# EAGLE design Wheel_Encoder_Adapter_Schmitt_74LVC (EAGLE 6.3)
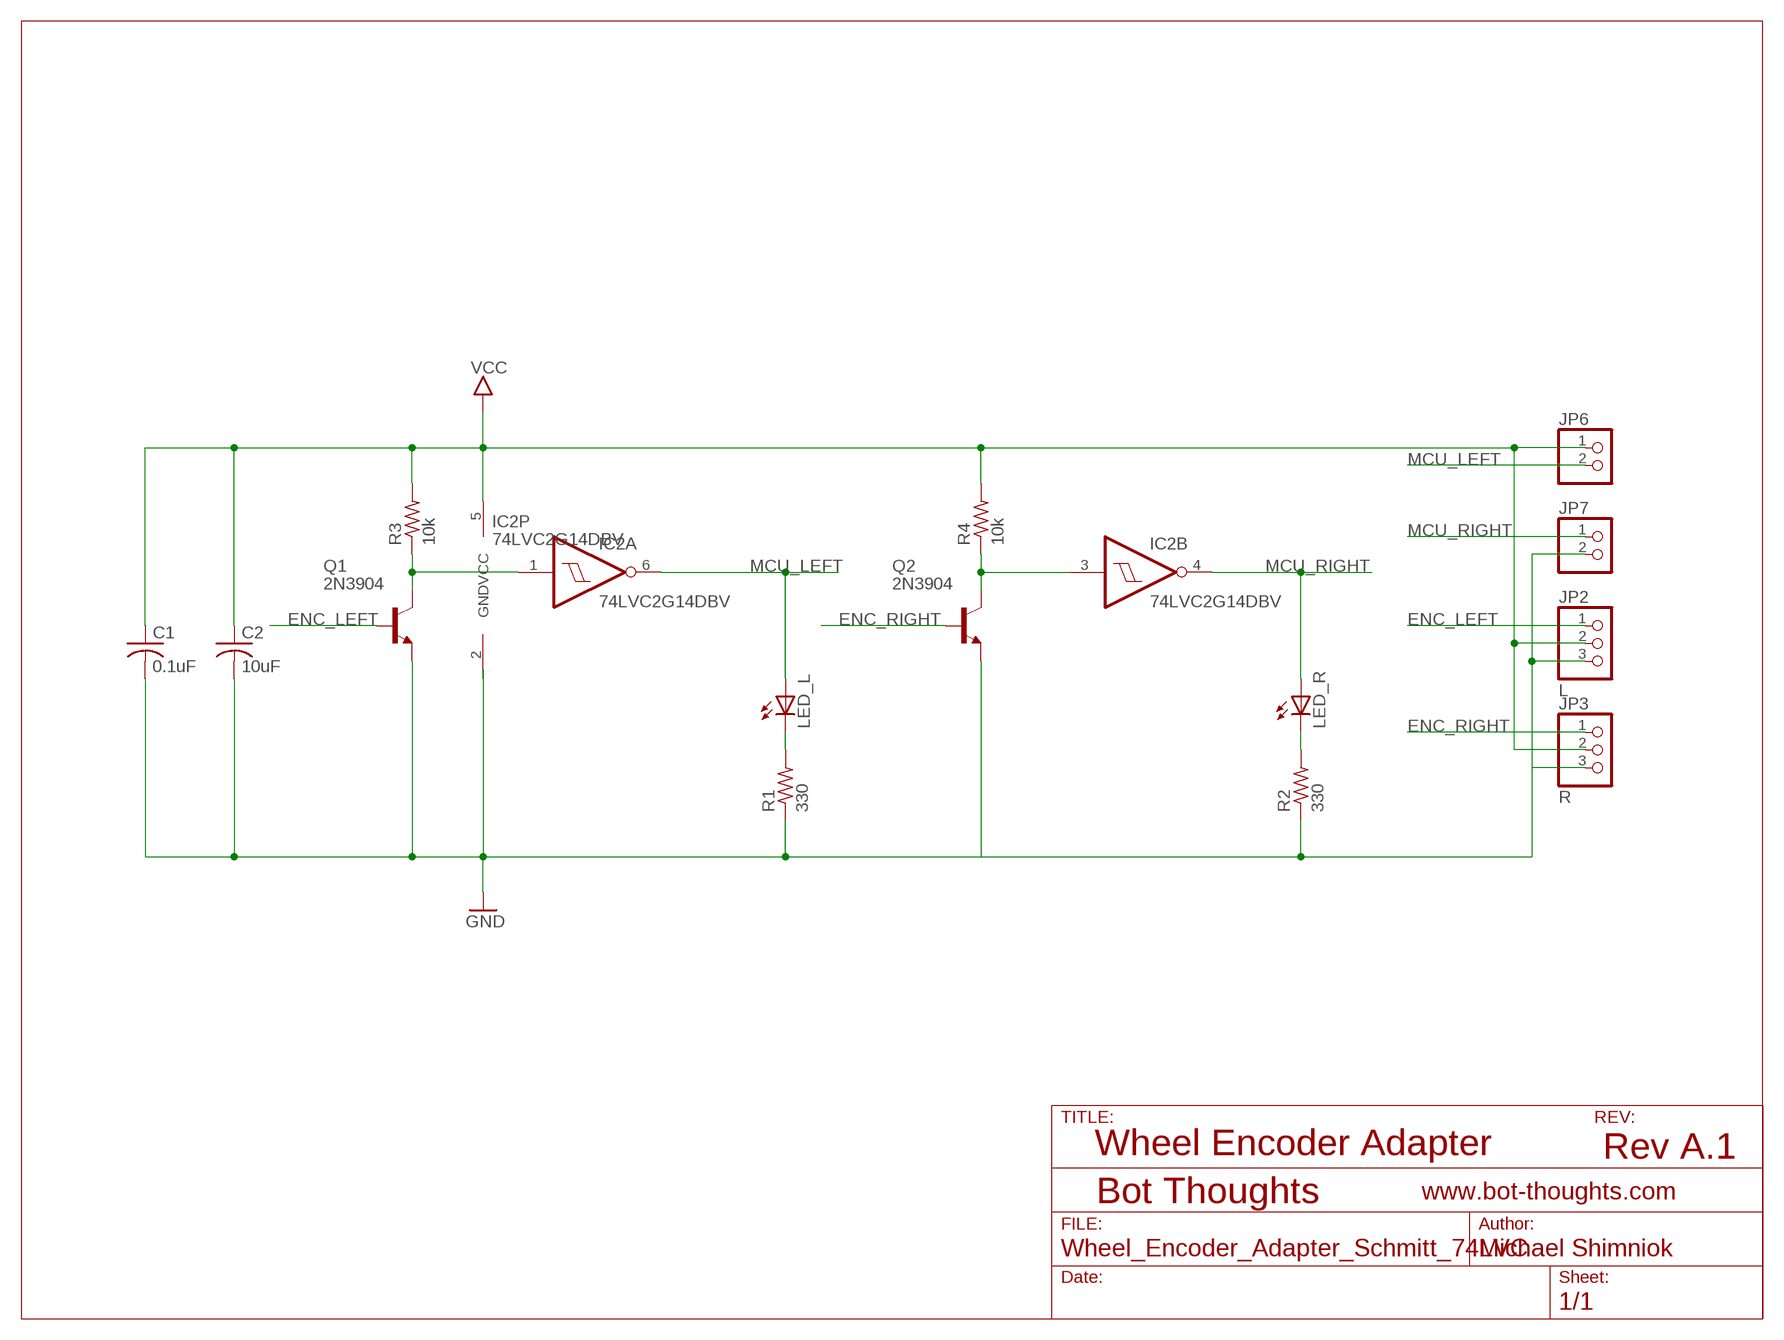
[diagram p0: schematic, sheet 1]

## Parts
C1  0.1uF  C-USC0603  [C0603]
C2  10uF  C-USC0603  [C0603]
IC2  74LVC2G14DBV  [SOT23-6]
JP2  L  PINHD-1X03_2.54-S  [1X03-S]
JP3  R  PINHD-1X03_2.54-S  [1X03-S]
JP6  PINHD-1X02_2.54-S  [1X02-S]
JP7  PINHD-1X02_2.54-S  [1X02-S]
LED_L  LEDCHIPLED_0805  [CHIPLED_0805]
LED_R  LEDCHIPLED_0805  [CHIPLED_0805]
Q1  2N3904  2N3904SMD  [SOT-23]
Q2  2N3904  2N3904SMD  [SOT-23]
R1  330  R-US_R0603  [R0603]
R2  330  R-US_R0603  [R0603]
R3  10k  R-US_R0603  [R0603]
R4  10k  R-US_R0603  [R0603]

## Nets
ENC_LEFT: JP2.1 Q1.3(B)
ENC_RIGHT: JP3.1 Q2.3(B)
GND: C1.2 C2.2 IC2.2(P:GND) JP2.3 JP3.3 JP7.2 Q1.2(E) Q2.2(E) R1.1 R2.1
MCU_LEFT: IC2.6(A:O) JP6.2 LED_L.A
MCU_RIGHT: IC2.4(B:O) JP7.1 LED_R.A
N$1: LED_L.C R1.2
N$2: LED_R.C R2.2
N$6: IC2.3(B:I) Q2.1(C) R4.1
N$7: IC2.1(A:I) Q1.1(C) R3.1
VCC: C1.1 C2.1 IC2.5(P:VCC) JP2.2 JP3.2 JP6.1 R3.2 R4.2

## Notes on the sheet
- Wheel Encoder Adapter | Rev A.1

## Library data of the parts
C1 C2 = rcl:C-US: CAPACITOR, American symbol
IC2 = ads4:74LVC2G14: Texas Instruments 74LVC2G14 Dual Schmitt Trigger Inverter
JP2 JP3 = pinhead-2:PINHD-1X03: PIN HEADER
JP6 JP7 = pinhead-2:PINHD-1X02: PIN HEADER
LED_L LED_R = led:LED: LED OSRAM: - CHIPLED LG R971, LG N971, LY N971, LG Q971, LY Q971, LO R971, LY R971 LH N974, LH R974 LS Q976, LO Q976, LY Q976 LO Q996 - Hyper CHIPLED LW Q18S LB Q993, LB Q99A, LB R99A - SideLED LS A670, LO A670, LY A670, LG A670, LP A670 LB A673, LV A673, LT A673, LW A673 LH A674 LY A675 LS A676, LA A676, LO A676, LY A676, LW A676 LS A679, LY A679, LG A679 - Hyper Micro SIDELED® LS Y876, LA Y876, LO Y876, LY Y876 LT Y87S - SmartLED LW L88C, LW L88S LB L89C, LB L89S, LG L890 LS L89K, LO L89K, LY L89K LS L896, LA L896, LO L896, LY L896 - TOPLED LS T670, LO T670, LY T670, LG T670, LP T670 LSG T670, LSP T670, LSY T670, LOP T670, LYG T670 LG T671, LOG T671, LSG T671 LB T673, LV T673, LT T673, LW T673 LH T674 LS T676, LA T676, LO T676, LY T676, LB T676, LH T676, LSB T676, LW T676 LB T67C, LV T67C, LT T67C, LS T67K, LO T67K, LY T67K, LW E67C LS E67B, LA E67B, LO E67B, LY E67B, LB E67C, LV E67C, LT E67C LW T67C LS T679, LY T679, LG T679 LS T770, LO T770, LY T770, LG T770, LP T770 LB T773, LV T773, LT T773, LW T773 LH T774 LS E675, LA E675, LY E675, LS T675 LS T776, LA T776, LO T776, LY T776, LB T776 LHGB T686 LT T68C, LB T68C - Hyper Mini TOPLED® LB M676 - Mini TOPLED Santana® LG M470 LS M47K, LO M47K, LY M47K Source: http://www.osram.convergy.de LUXEON: - LUMILED® LXK2-PW12-R00, LXK2-PW12-S00, LXK2-PW14-U00, LXK2-PW14-V00 LXK2-PM12-R00, LXK2-PM12-S00, LXK2-PM14-U00 LXK2-PE12-Q00, LXK2-PE12-R00, LXK2-PE12-S00, LXK2-PE14-T00, LXK2-PE14-U00 LXK2-PB12-K00, LXK2-PB12-L00, LXK2-PB12-M00, LXK2-PB14-N00, LXK2-PB14-P00, LXK2-PB14-Q00 LXK2-PR12-L00, LXK2-PR12-M00, LXK2-PR14-Q00, LXK2-PR14-R00 LXK2-PD12-Q00, LXK2-PD12-R00, LXK2-PD12-S00 LXK2-PH12-R00, LXK2-PH12-S00 LXK2-PL12-P00, LXK2-PL12-Q00, LXK2-PL12-R00 Source: www.luxeon.com KINGBRIGHT: KA-3528ASYC Source: www.kingbright.com
Q1 Q2 = mes_transistors:2N3904: NPN Transistor Small signal NPN Bipolar Junction Transistor (BJT). Use this device to represent any of a number of such transistors with similar package and pinout: 2N4401, 2N3904, 2N2222, etc.
R1-R4 = rcl:R-US_: RESISTOR, American symbol

## Board
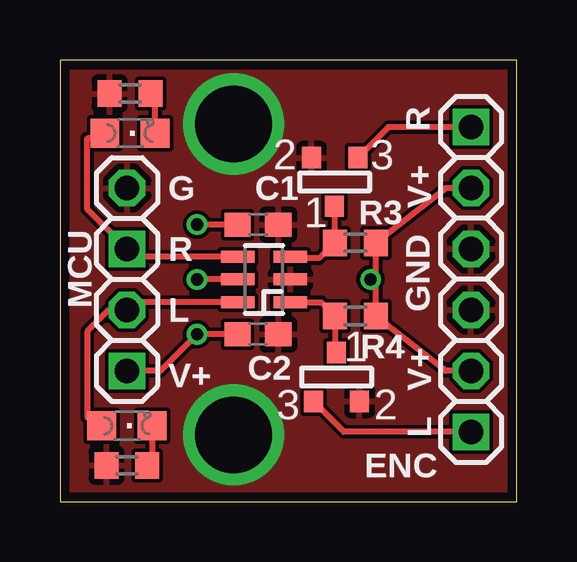
[diagram p1: board, top side]
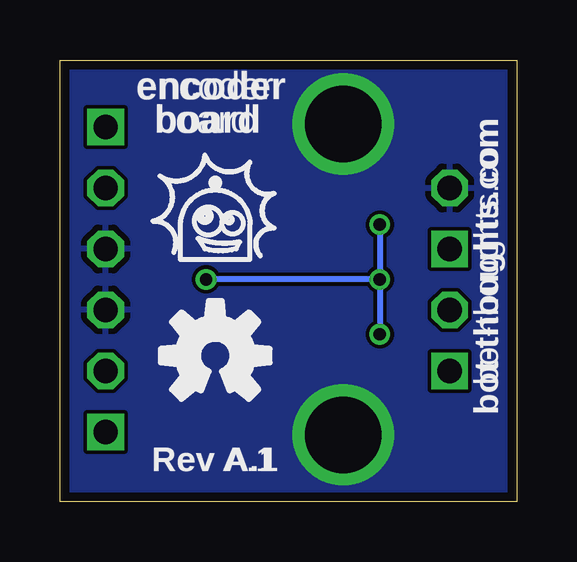
[diagram p2: board, bottom side, seen from below]

Size 19.05 x 18.41 mm. Coordinates in mm from the lower left corner, seen from the top.
Outline: 0,0 19.05,0 19.05,18.41 0,18.41 0,0
Copper layers (1*16): Top 0.0356mm / dielectric 1.5011mm / Bottom 0.0356mm
Design rules "default *": minimum track width 6mil, minimum drill 13mil, track to track 6mil, track to pad 6mil, pad to pad 6mil, via to via 6mil, smd to smd 6mil, copper to edge 15mil, drill to drill 6mil, minimum pad ring 7mil, minimum via ring 7mil, stop-mask expansion 4mil, vias tented up to drill 20mil, thermal gap 10mil

### Footprints (pad centres in the part's own frame; a part is rotated, then mirrored left to right if it is on the bottom)
C0603 = smd 1.1 x 1: 1 -0.85,0; 2 0.85,0
SOT23-6 = smd 0.5 x 1.4: 1 -0.95,-1.1; 2 0,-1.1; 3 0.95,-1.1; 4 0.95,1.1; 5 0,1.1; 6 -0.95,1.1
1X03-S = drill 1.016 square: 1 -2.54,0 | drill 1.016 octagon: 2 0,0; 3 2.54,0
1X02-S = drill 1.016 square: 1 -1.27,0 | drill 1.016 octagon: 2 1.27,0
CHIPLED_0805 = smd 1.2 x 1.2: A 0,-1.05; C 0,1.05
SOT-23 = smd 0.787 x 0.889: 1 0.025,-1.016; 2 -0.94,1.016; 3 0.991,1.016
R0603 = smd 1 x 1.1: 1 -0.85,0; 2 0.85,0

### Placement (x,y rotation side)
C1  8.26,11.56 0 top
C2  8.26,6.99 0 top
IC2  8.51,9.27 90 top
JP2  17.14,5.46 90 top
JP3  17.14,13.08 270 top
JP6  2.79,6.73 90 top
JP7  2.79,11.81 90 top
LED_L  2.79,3.17 270 top
LED_R  2.92,15.37 270 top
Q1  11.56,5.21 180 top
Q2  11.43,13.34 0 top
R1  2.79,1.52 0 top
R2  2.92,17.02 0 top
R3  12.32,7.75 0 top
R4  12.32,10.79 0 top

### Tracks (layer width: path | path; a pad name or v marks a point on that pad's centre or on a via)
ENC_LEFT
  Top 0.254: JP2.1 11.84,2.92 Q1.3
ENC_RIGHT
  Top 0.254: JP3.1 13.69,15.62 Q2.3
GND  (via drill 3.2)
  other vias: 7.24,15.75 7.24,2.79
  pour Top: 0,18.41 19.05,18.41 19.05,0 0,0
  pour Bottom: 0,0 19.05,0 19.05,18.41 0,18.41
MCU_LEFT
  Top 0.254: LED_L.A 1.14,3.52 1.14,7.11 2.03,8 JP6.2 3.11,8.32 IC2.6
MCU_RIGHT
  Top 0.254: LED_R.A 1.14,15.15 1.14,12.19 JP7.1 3.11,10.22 IC2.4
N$1
  Top 0.254: LED_L.C 3.84,1.6 R1.2
N$2
  Top 0.254: LED_R.C 3.97,16.82 R2.2
N$6
  Top 0.254: IC2.3 10.05,10.16 10.79,10.16 R4.1 11.46,11.32 Q2.1
N$7
  Top 0.254: IC2.1 10.9,8.32 R3.1 11.47,6.29 Q1.1
VCC  (via drill 0.51)
  Top 0.254: 13.17,9.27 R3.2 16.09,5.46 JP2.2 | 13.17,9.27 R4.2 16.09,13.08 JP3.2 | IC2.5 v5.71,9.27 | JP6.1 4.19,5.46 v5.71,6.99 C2.1 | C1.1 v5.71,11.56 | v12.95,9.27 13.17,9.27
  Bottom 0.254: v5.71,9.27 v5.71,6.99 | v5.71,11.56 v5.71,9.27 | v5.71,9.27 v12.95,9.27

### Text on the board
tPlace: MCU | ENC
tNames: G | V+ | R | GND | L | V+ | V+
bNames: encoder | bot-thoughts.com | board | Rev A.1
tsilk: R | G | C1 | R3 | V+ | R | MCU | GND | L | R4 | C2 | V+ | V+ | L | ENC
bsilk: encoder | bot-thoughts.com | board | Rev A.1